# Altium schematic sheet Quectel_EC600N-CN_R1.1_SCH_Part_AD_V1.0.SchDoc
size A1
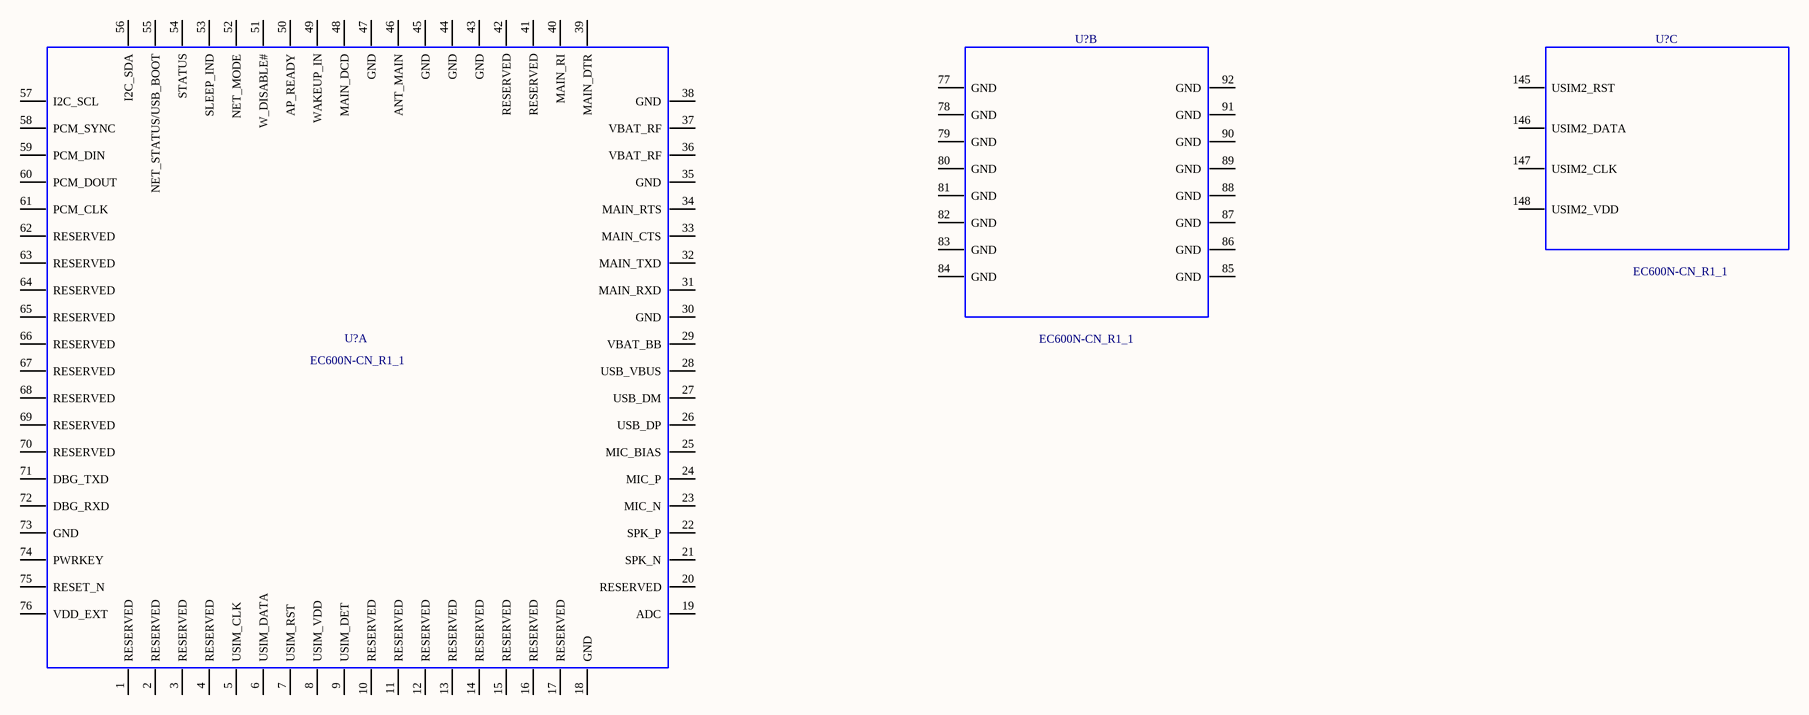
[diagram p0: Quectel_EC600N-CN_R1.1_SCH_Part_AD_V1.0.SchDoc]

## Parts
(Parts that share a designator on the sheet are numbered #1, #2 ... from top to bottom, then left to right.)
U?#1  EC600N-CN_R1_1  (part C of 3)
U?#2  EC600N-CN_R1_1  (part B of 3)
U?#3  EC600N-CN_R1_1  (part A of 3)

## Nets

Not connected (* = marked no-connect by the designer): U?#1 145(USIM2_RST) 146(USIM2_DATA) 147(USIM2_CLK) 148(USIM2_VDD); U?#2 77(GND) 78(GND) 79(GND) 80(GND) 81(GND) 82(GND) 83(GND) 84(GND) 85(GND) 86(GND) 87(GND) 88(GND) 89(GND) 90(GND) 91(GND) 92(GND); U?#3 1(RESERVED) 2(RESERVED) 3(RESERVED) 4(RESERVED) 5(USIM_CLK) 6(USIM_DATA) 7(USIM_RST) 8(USIM_VDD) 9(USIM_DET) 10(RESERVED) 11(RESERVED) 12(RESERVED) 13(RESERVED) 14(RESERVED) 15(RESERVED) 16(RESERVED) 17(RESERVED) 18(GND) 19(ADC) 20(RESERVED) 21(SPK_N) 22(SPK_P) 23(MIC_N) 24(MIC_P) 25(MIC_BIAS) 26(USB_DP) 27(USB_DM) 28(USB_VBUS) 29(VBAT_BB) 30(GND) 31(MAIN_RXD) 32(MAIN_TXD) 33(MAIN_CTS) 34(MAIN_RTS) 35(GND) 36(VBAT_RF) 37(VBAT_RF) 38(GND) 39(MAIN_DTR) 40(MAIN_RI) 41(RESERVED) 42(RESERVED) 43(GND) 44(GND) 45(GND) 46(ANT_MAIN) 47(GND) 48(MAIN_DCD) 49(WAKEUP_IN) 50(AP_READY) 51(W_DISABLE#) 52(NET_MODE) 53(SLEEP_IND) 54(STATUS) 55(NET_STATUS/USB_BOOT) 56(I2C_SDA) 57(I2C_SCL) 58(PCM_SYNC) 59(PCM_DIN) 60(PCM_DOUT) 61(PCM_CLK) 62(RESERVED) 63(RESERVED) 64(RESERVED) 65(RESERVED) 66(RESERVED) 67(RESERVED) 68(RESERVED) 69(RESERVED) 70(RESERVED) 71(DBG_TXD) 72(DBG_RXD) 73(GND) 74(PWRKEY) 75(RESET_N) 76(VDD_EXT)

## Library data of the parts
U?#1-U?#3 = EC600N-CN_R1_1: EC600N-CN_V1_2  Module 76LCC 20LGA 21.9x22.9mm H2.2mm RO; Manufacturer: Quectel; Part Description: EC600N-CN_R1_1  Module 76LCC 20LGA 21.9x22.9mm H2.2mm RO; Geometry.Height: 2.2mm; Value: EC600N-CN_R1_1